# Altium schematic sheet Fuse map.SchDoc: Fuse map
size A3; Author: Vi Tín; SheetNumber: 14; SheetTotal: 15
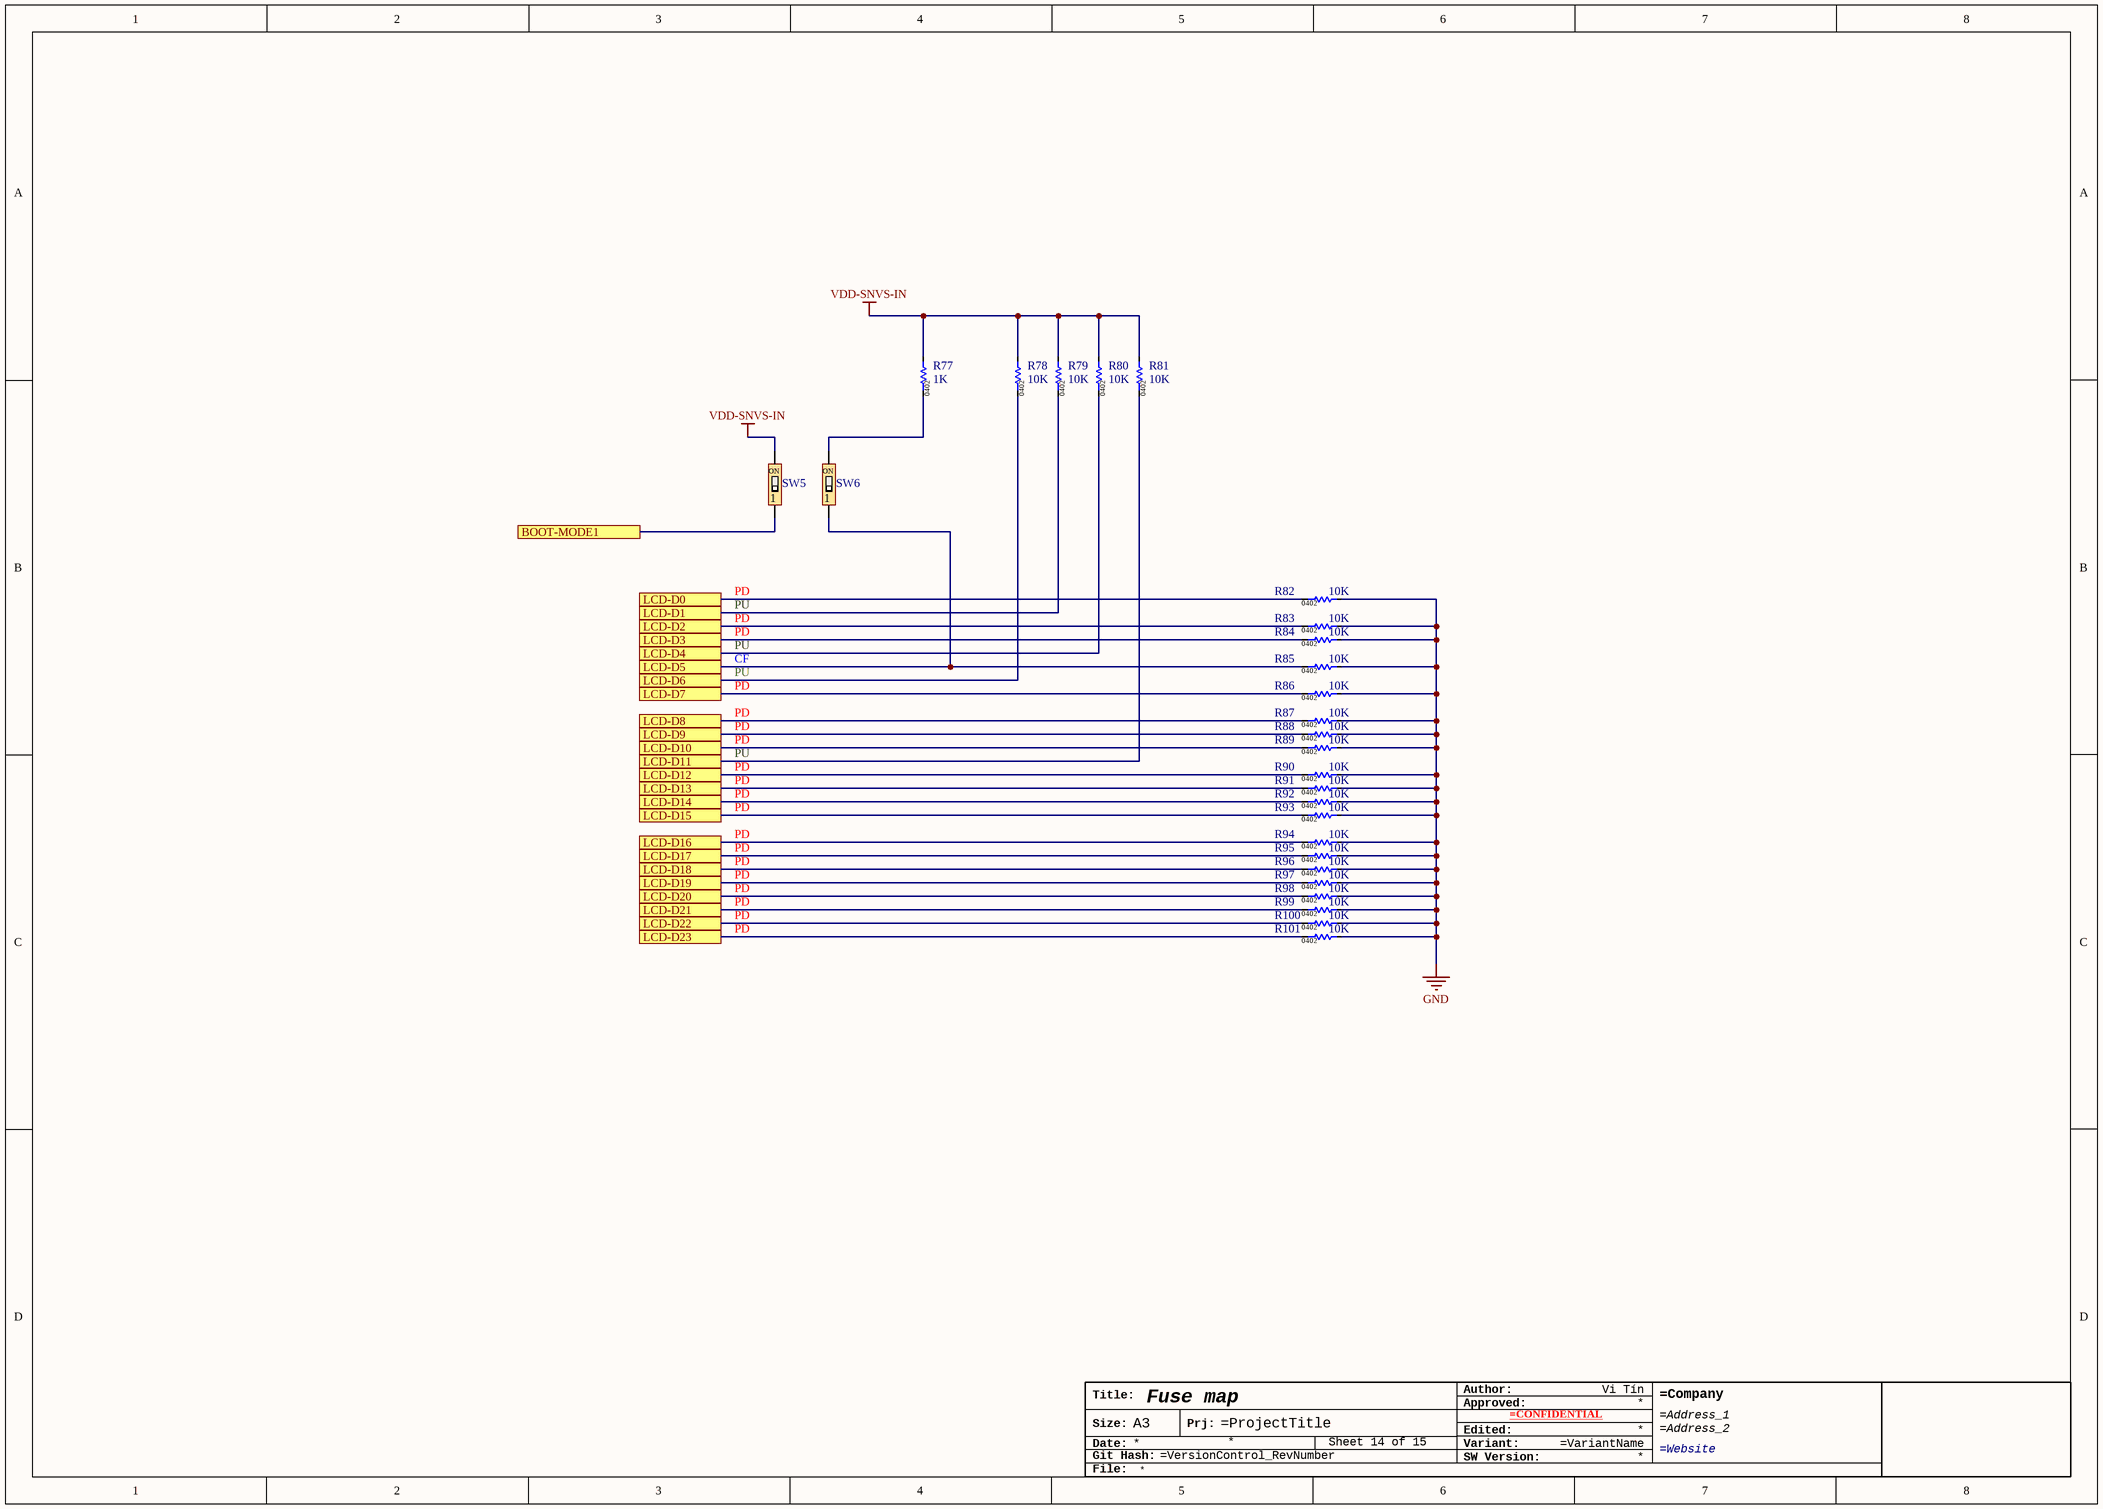
[diagram p0: Fuse map.SchDoc]

## Parts
*?  TitleBlock_Generic  (value not drawn)  (graphical)
R77  1K  [RES-0402]
R78  10K  [RES-0402]
R79  10K  [RES-0402]
R80  10K  [RES-0402]
R81  10K  [RES-0402]
R82  10K  [RES-0402]
R83  10K  [RES-0402]
R84  10K  [RES-0402]
R85  10K  [RES-0402]
R86  10K  [RES-0402]
R87  10K  [RES-0402]
R88  10K  [RES-0402]
R89  10K  [RES-0402]
R90  10K  [RES-0402]
R91  10K  [RES-0402]
R92  10K  [RES-0402]
R93  10K  [RES-0402]
R94  10K  [RES-0402]
R95  10K  [RES-0402]
R96  10K  [RES-0402]
R97  10K  [RES-0402]
R98  10K  [RES-0402]
R99  10K  [RES-0402]
R100  10K  [RES-0402]
R101  10K  [RES-0402]
SW5  DSHP01TSGET  [DIP Switches 1.27 (1)]  (value not drawn)
SW6  DSHP01TSGET  [DIP Switches 1.27 (1)]  (value not drawn)

## Ports
BOOT-MODE1, LCD-D0, LCD-D1, LCD-D2, LCD-D3, LCD-D4, LCD-D5, LCD-D6, LCD-D7, LCD-D8, LCD-D9, LCD-D10, LCD-D11, LCD-D12, LCD-D13, LCD-D14, LCD-D15, LCD-D16, LCD-D17, LCD-D18, LCD-D19, LCD-D20, LCD-D21, LCD-D22, LCD-D23

## Nets
GND: R82.2 R83.2 R84.2 R85.2 R86.2 R87.2 R88.2 R89.2 R90.2 R91.2 R92.2 R93.2 R94.2 R95.2 R96.2 R97.2 R98.2 R99.2 R100.2 R101.2
VDD-SNVS-IN: R77.2 R78.2 R79.2 R80.2 R81.2 SW5.2
BOOT-MODE1: SW5.1 ; port BOOT-MODE1
LCD-D0: R82.1 ; port LCD-D0
LCD-D1: R79.1 ; port LCD-D1
LCD-D2: R83.1 ; port LCD-D2
LCD-D3: R84.1 ; port LCD-D3
LCD-D4: R80.1 ; port LCD-D4
LCD-D5: R85.1 SW6.1 ; port LCD-D5
LCD-D6: R78.1 ; port LCD-D6
LCD-D7: R86.1 ; port LCD-D7
LCD-D8: R87.1 ; port LCD-D8
LCD-D9: R88.1 ; port LCD-D9
LCD-D10: R89.1 ; port LCD-D10
LCD-D11: R81.1 ; port LCD-D11
LCD-D12: R90.1 ; port LCD-D12
LCD-D13: R91.1 ; port LCD-D13
LCD-D14: R92.1 ; port LCD-D14
LCD-D15: R93.1 ; port LCD-D15
LCD-D16: R94.1 ; port LCD-D16
LCD-D17: R95.1 ; port LCD-D17
LCD-D18: R96.1 ; port LCD-D18
LCD-D19: R97.1 ; port LCD-D19
LCD-D20: R98.1 ; port LCD-D20
LCD-D21: R99.1 ; port LCD-D21
LCD-D22: R100.1 ; port LCD-D22
LCD-D23: R101.1 ; port LCD-D23
NetR77_1: R77.1 SW6.2

## Notes on the sheet
- PU
- PD
- CF
- (in symbol DSHP01TSGET) ON
- (in symbol TitleBlock_Generic) Author:; Title:; Approved:; Size:; A3; Prj:; Edited:; Date:; Variant:; SW Version:; Git Hash:; File:

## Library data of the parts
R77 = WR04X1001FTL: 1kΩ ±1% 1/16W ±100ppm/℃ 0402 Chip Resistor - Surface Mount RoHS; Manufacture: WALSIN; Package / Case: 0201; Component type: Resistor; Manufacture part: WR04X1001FTL; Resistor value: 1K; Package: 0402
R78-R101 = WR04X1002FTL: 10kΩ ±1% 1/16W ±100ppm/℃ 0402 Chip Resistor - Surface Mount RoHS; Manufacture: WALSIN; Package / Case: 0201; Component type: Resistor; Manufacture part: WR04X1002FTL; Resistor value: 10K; Package: 0402
SW5 SW6 = DSHP01TSGET: SPST 1 1.27mm, Half Slide (Standard) Black SMD DIP Switches RoHS; Manufacture: Dongguan Guangzhu Industrial; Manufacture part: DSHP01TSGET; Type: DIP Switches; Datasheet: https://datasheet.lcsc.com/lcsc/1810191310_Dongguan-Guangzhu-Industrial-DSHP01TSGET_C126848.pdf
*? = TitleBlock_Generic: Manufacture part: TitleBlock_Generic; Manufacture: N/A; Type: Graphic